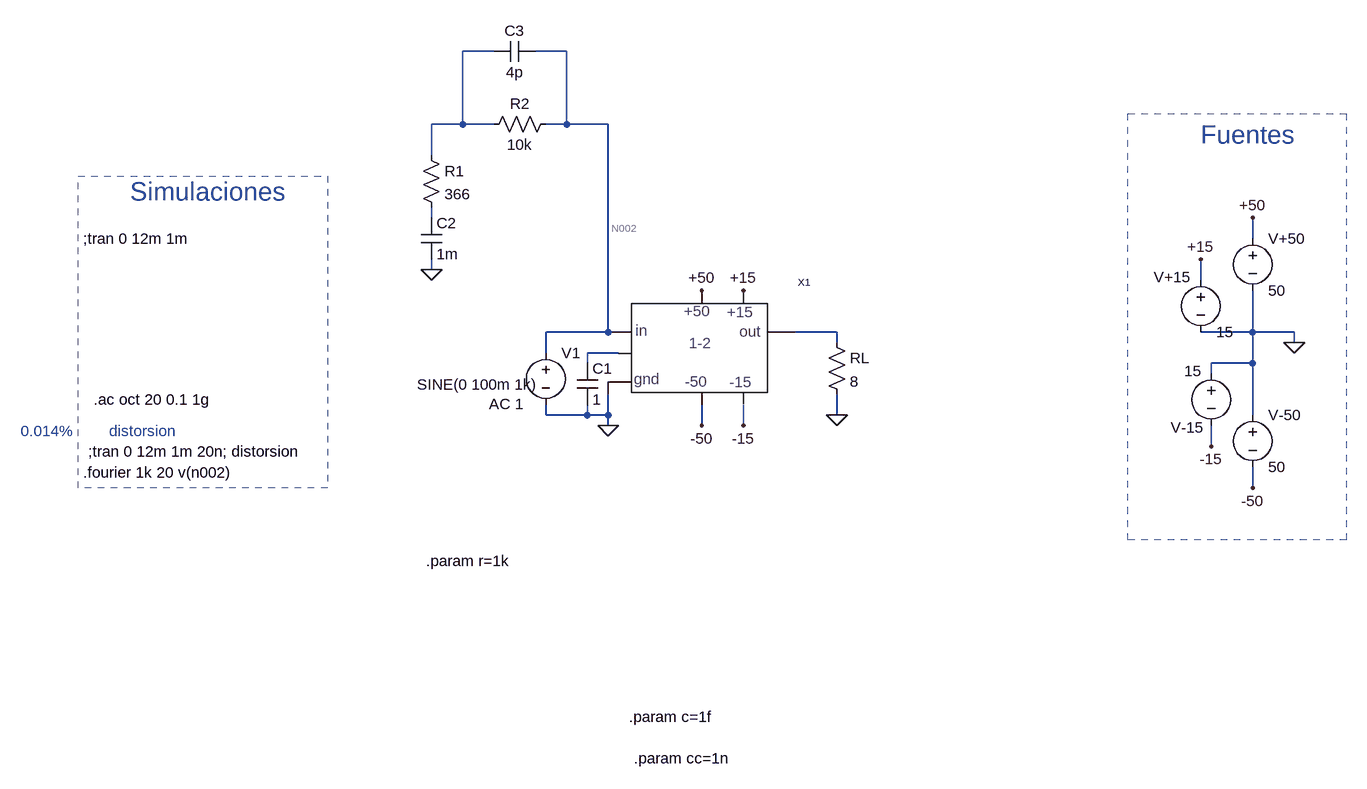
[diagram p0: schematic ampli-1-2-la.asc]
ampli-1-2-la.asc, the LTspice schematic file:
Version 4
SHEET 1 1188 800
WIRE -128 -320 -176 -320
WIRE -16 -320 -64 -320
WIRE -176 -208 -176 -320
WIRE -176 -208 -224 -208
WIRE -128 -208 -176 -208
WIRE -16 -208 -16 -320
WIRE -16 -208 -48 -208
WIRE 48 -208 -16 -208
WIRE -224 -160 -224 -208
WIRE -224 -64 -224 -80
WIRE 1040 -32 1040 -64
WIRE -224 16 -224 0
WIRE 960 32 960 0
WIRE 48 112 48 -208
WIRE 48 112 -48 112
WIRE 400 112 336 112
WIRE 1040 112 1040 48
WIRE 1040 112 960 112
WIRE 1104 112 1040 112
WIRE 400 128 400 112
WIRE 1104 128 1104 112
WIRE -48 144 -48 112
WIRE 64 144 16 144
WIRE 16 160 16 144
WIRE 1040 160 1040 112
WIRE 1040 160 976 160
WIRE 976 176 976 160
WIRE -48 240 -48 224
WIRE 16 240 16 224
WIRE 16 240 -48 240
WIRE 48 240 48 208
WIRE 48 240 16 240
WIRE 400 240 400 208
WIRE 1040 240 1040 160
WIRE 48 256 48 240
WIRE 192 256 192 224
WIRE 256 256 256 224
WIRE 976 288 976 256
WIRE 1040 352 1040 320
FLAG 1104 128 0
FLAG 400 240 0
FLAG 1040 -64 +50
FLAG 960 0 +15
FLAG 976 288 -15
FLAG 1040 352 -50
FLAG 192 48 +50
FLAG 256 48 +15
FLAG 192 256 -50
FLAG 256 256 -15
FLAG 48 256 0
FLAG -224 16 0
SYMBOL rui\\shortcuts\\voltage 976 160 R0
WINDOW 0 -62 99 Left 2
WINDOW 3 -41 12 Left 2
WINDOW 123 0 0 Left 2
WINDOW 39 0 0 Left 2
SYMATTR InstName V-15
SYMATTR Value 15
SYMBOL rui\\shortcuts\\voltage 1040 -48 R0
SYMATTR InstName V+50
SYMATTR Value 50
SYMBOL rui\\shortcuts\\voltage 960 16 R0
WINDOW 0 -72 11 Left 2
SYMATTR InstName V+15
SYMATTR Value 15
SYMBOL rui\\shortcuts\\voltage -48 128 R0
WINDOW 3 -198 65 Left 2
WINDOW 123 -87 95 Left 2
WINDOW 39 0 0 Left 2
SYMATTR Value SINE(0 100m 1k)
SYMATTR Value2 AC 1
SYMATTR InstName V1
SYMBOL res 384 112 R0
SYMATTR InstName RL
SYMATTR Value 8
SYMBOL rui\\shortcuts\\voltage 1040 224 R0
SYMATTR InstName V-50
SYMATTR Value 50
SYMBOL cap 0 160 R0
SYMATTR InstName C1
SYMATTR Value 1
SYMBOL res -240 -176 R0
SYMATTR InstName R1
SYMATTR Value 366
SYMBOL res -32 -224 R90
WINDOW 0 0 56 VBottom 2
WINDOW 3 32 56 VTop 2
SYMATTR InstName R2
SYMATTR Value 10k
SYMBOL cap -240 -64 R0
SYMATTR InstName C2
SYMATTR Value 1m
SYMBOL cap -64 -336 R90
WINDOW 0 0 32 VBottom 2
WINDOW 3 32 32 VTop 2
SYMATTR InstName C3
SYMATTR Value 4p
SYMBOL ss-ampli-1-2 192 128 R0
SYMATTR InstName X1
TEXT -760 -32 Left 2 !;tran 0 12m 1m
TEXT -760 328 Left 2 !.fourier 1k 20 v(n002)
TEXT 960 -192 Left 4 ;Fuentes
TEXT -688 -104 Left 4 ;Simulaciones
TEXT -752 296 Left 2 !;tran 0 12m 1m 20n; distorsion
TEXT -720 264 Left 2 ;distorsion
TEXT -856 264 Left 2 ;0.014%
TEXT -744 216 Left 2 !.ac oct 20 0.1 1g
TEXT -232 464 Left 2 !.param r=1k
TEXT 88 768 Left 2 !.param cc=1n
TEXT 80 704 Left 2 !.param c=1f
RECTANGLE Normal 1184 432 848 -224 2
RECTANGLE Normal -384 352 -768 -128 2

The netlist it stands for:
* ampli-1-2-la.asc
V-15 0 -15 15
V+50 +50 0 50
V+15 +15 0 15
V1 N002 0 SINE(0 100m 1k) AC 1
RL N004 0 8
V-50 0 -50 50
C1 N005 0 1
R1 N001 N003 366
R2 N002 N001 10k
C2 N003 0 1m
C3 N002 N001 4p
XX1 0 N002 N004 +50 -50 +15 -15 N005 ss-ampli-1-2  ; pins grnd i o +50 -50 +15 -15 i_aux
;tran 0 12m 1m
.fourier 1k 20 v(n002)
* Fuentes
* Simulaciones
;tran 0 12m 1m 20n; distorsion
* distorsion
* 0.014%
.ac oct 20 0.1 1g
.param r=1k
.param cc=1n
.param c=1f
.backanno
.end